# EasyEDA Pro project ProPrj_hackpod.epro

# Schematic Schematic1
Board Name: Board1; Create Date: 2025-11-21; Page Name: P1; Project Name: hackpod; Schematic Name: Schematic1; Update Date: 2025-12-06; Company: wenfeng110402; Drawed: 叶文峰; Page Size: A4; Reviewed: 叶文峰; Version: V1.0
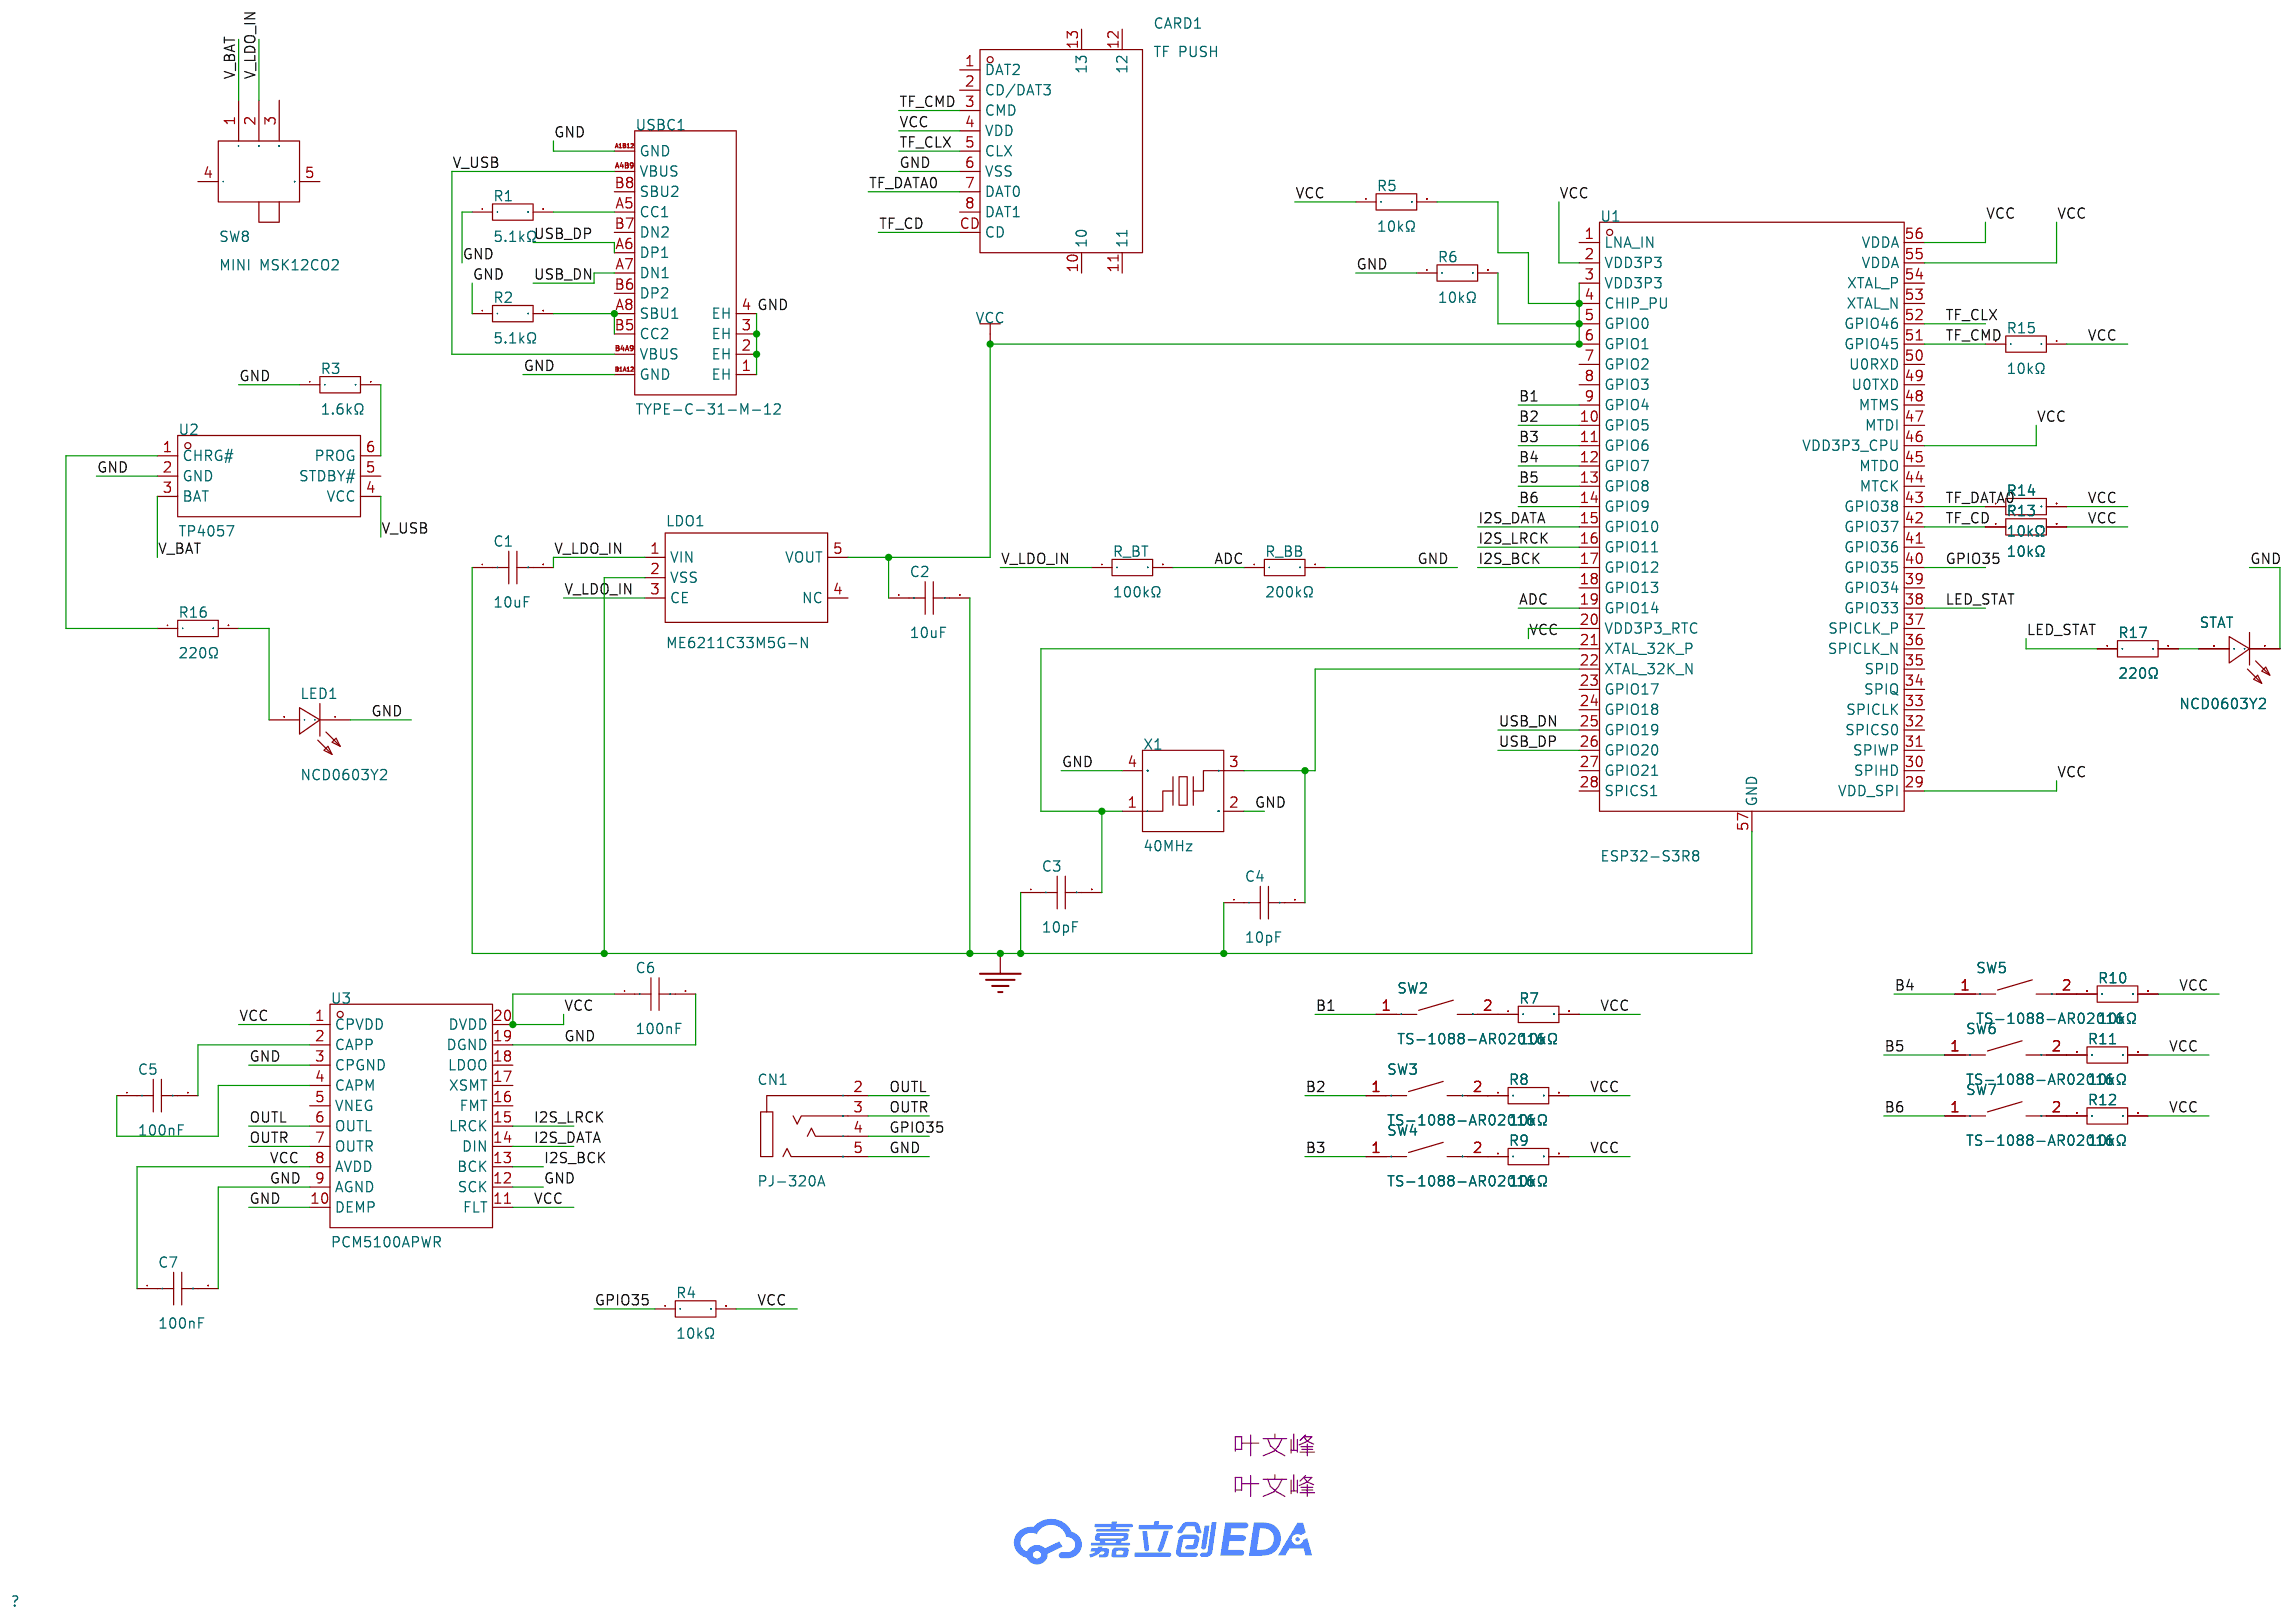
[diagram p0: schematic sheet]

## Parts
C1  10uF  [C0603]
C2  10uF  [C0603]
C3  10pF  [C0603]
C4  10pF  [C0603]
C5  100nF  [C0603]
C6  100nF  [C0603]
C7  100nF  [C0603]
CARD1  TF PUSH  [TF-SMD_TF-PUSH]
CN1  PJ-320A  [AUDIO-TH_PJ-320A_C49284721]
LDO1  ME6211C33M5G-N  [SOT-23-5_L3.0-W1.7-P0.95-LS2.8-BL]
LED1  NCD0603Y2  [LED0603-RD]
R1  5.1kΩ  [R0603]
R2  5.1kΩ  [R0603]
R3  1.6kΩ  [R0603]
R4  10kΩ  [R0603]
R5  10kΩ  [R0603]
R6  10kΩ  [R0603]
R7  10kΩ  [R0603]
R8  10kΩ  [R0603]
R9  10kΩ  [R0603]
R10  10kΩ  [R0603]
R11  10kΩ  [R0603]
R12  10kΩ  [R0603]
R13  10kΩ  [R0603]
R14  10kΩ  [R0603]
R15  10kΩ  [R0603]
R16  220Ω  [R0603]
R17  220Ω  [R0603]
R_BB  200kΩ  [R0603]
R_BT  100kΩ  [R0603]
STAT  NCD0603Y2  [LED0603-RD]
SW2  TS-1088-AR02016  [SW-SMD_L3.9-W3.0-P4.45]
SW3  TS-1088-AR02016  [SW-SMD_L3.9-W3.0-P4.45]
SW4  TS-1088-AR02016  [SW-SMD_L3.9-W3.0-P4.45]
SW5  TS-1088-AR02016  [SW-SMD_L3.9-W3.0-P4.45]
SW6  TS-1088-AR02016  [SW-SMD_L3.9-W3.0-P4.45]
SW7  TS-1088-AR02016  [SW-SMD_L3.9-W3.0-P4.45]
SW8  MINI MSK12CO2  [SW-SMD_MSK12CO2]
U1  ESP32-S3R8  [QFN-56_L7.0-W7.0-P0.40-TL-EP4.0]
U2  TP4057  [SOT-23-6_L2.9-W1.6-P0.95-LS2.8-BR]
U3  PCM5100APWR  [TSSOP-20_L6.5-W4.4-P0.65-LS6.4-BL]
USBC1  TYPE-C-31-M-12  [USB-C_SMD-TYPE-C-31-M-12_1]
X1  40MHz  [CRYSTAL-SMD_4P-L3.2-W2.5-BL]

## Library data of the parts
C1 C2 = CL10A106MA8NRNC: 容值:10uF;精度:±20%;额定电压:25V;温度系数:X5R;; LCSC Part Name: 10uF ±20% 25V; Supplier Part: C96446; Manufacturer: SAMSUNG(三星); Supplier Footprint: 0603; JLCPCB Part Class: Basic Part; Datasheet: https://item.szlcsc.com/datasheet/CL10A106MA8NRNC/97651.html; Supplier: LCSC; Tolerance: ±20%; Voltage Rating: 25V; Temperature Coefficient: X5R
C3 C4 = CL10C100JB8NNNC: 容值:10pF;精度:±5%;额定电压:50V;温度系数:C0G;; LCSC Part Name: 10pF ±5% 50V; Supplier Part: C1634; Manufacturer: SAMSUNG(三星); Supplier Footprint: 0603; JLCPCB Part Class: Basic Part; Datasheet: https://item.szlcsc.com/datasheet/CL10C100JB8NNNC/1986.html; Supplier: LCSC; Tolerance: ±5%; Voltage Rating: 50V; Temperature Coefficient: C0G
C5-C7 = CL10B104KB8NNNC: 容值:100nF;精度:±10%;额定电压:50V;温度系数:X7R;; LCSC Part Name: 100nF ±10% 50V; Supplier Part: C1591; Manufacturer: SAMSUNG(三星); Supplier Footprint: 0603; JLCPCB Part Class: Extended Part; Datasheet: https://item.szlcsc.com/datasheet/CL10B104KB8NNNC/1943.html; Supplier: LCSC; Tolerance: ±10%; Voltage Rating: 50V; Temperature Coefficient: X7R
CARD1 = TF PUSH: 卡连接方式:自弹式;卡类型:MicroSD卡(TF卡);连接器类型:卡座;本体最大高度:2mm;工作温度:-25℃~+90℃;; LCSC Part Name: 自弹式 MicroSD卡(TF卡) 卡座; Supplier Part: C393941; Manufacturer: SHOU HAN(首韩); Supplier Footprint: SMD; JLCPCB Part Class: 扩展库; Datasheet: https://item.szlcsc.com/datasheet/TF%2520PUSH/372553.html; Supplier: LCSC; Card Connection Mode: 自弹式; Card Type: MicroSD卡(TF卡); Connector Type: 卡座; Additional Card Detection Pins: 无; Height Above Board: 2mm; Operating Temperature: -25℃~+90℃
CN1 = PJ-320A_C49284721: 连接器类型:3.5mm耳机座;额定电流:500mA;额定电压:30V;触头材质:铜;触头镀层:金;工作温度:-25℃~+85℃;; LCSC Part Name: 3.5mm耳机座; Supplier Part: C49284721; Manufacturer: XUNPU(讯普); Supplier Footprint: SMD; JLCPCB Part Class: 扩展库; Datasheet: https://item.szlcsc.com/datasheet/PJ-320A/51736270.html; Supplier: LCSC; Connector Type: 3.5mm耳机座; Current Rating: 500mA; Voltage Rating (Max): 30V; Contact Material: 铜; Contact Plating: 金; Operating Temperature: -25℃~+85℃
LDO1 = ME6211C33M5G-N: 输出类型:固定;工作电压:6V;输出电压:3.3V;输出电流:500mA;电源纹波抑制比(PSRR):70dB@(1kHz);输出极性:正极;; LCSC Part Name: 输入6V 输出3.3V 500mA; Supplier Part: C82942; Manufacturer: MICRONE(南京微盟); Supplier Footprint: SOT-23-5; JLCPCB Part Class: 扩展库; Datasheet: https://item.szlcsc.com/datasheet/ME6211C33M5G-N/84106.html; Supplier: LCSC; Output Type: 固定; Voltage - Supply: 6V; Output Voltage: 3.3V; Output Current: 500mA; Power Supply Rejection Ratio (PSRR): 70dB@(1kHz); Voltage Dropout: 120mV@(100mA); standby current: 60uA; Noise: 50uVrms; Features: 过流保护；带使能；短路保护; Operating Temperature: -40℃~+150℃; Output Configuration: 正极; Number of Outputs: 1
LED1 STAT = NCD0603Y2: 发光颜色:黄色;正向电压(VF):1.6V~2.6V;功率:65mW;正向电流:20mA;主波长:586nm~595nm;透镜颜色:无色透明透镜;发光强度:100mcd~220mcd;发光角度:130°;工作温度:-30℃~+85℃;; Supplier Part: C89811; Manufacturer: 国星光电; Supplier Footprint: 0603; JLCPCB Part Class: 扩展库; Datasheet: https://atta.szlcsc.com/upload/public/pdf/source/20200820/C89811_7FE84B429B6BCA3E113B125EE1452576.pdf; Supplier: LCSC; Emitted Color: 黄色; Forward Voltage (VF): 1.6V~2.6V; Power Dissipation: 65mW; Forward Current: 20mA; Dominant Wavelength: 586nm~595nm; Lens Color: 无色透明透镜; Luminous Intensity: 100mcd~220mcd; Viewing Angle: 130°; Operating Temperature: -30℃~+85℃
R1 R2 = 0603WAF5101T5E: 电阻类型:厚膜电阻;阻值:5.1kΩ;精度:±1%;功率:100mW;工作电压:75V;温度系数:±100ppm/℃;; LCSC Part Name: 5.1kΩ ±1% 100mW 厚膜电阻; Supplier Part: C23186; Manufacturer: UNI-ROYAL(厚声); Supplier Footprint: 0603; JLCPCB Part Class: Basic Part; Datasheet: https://item.szlcsc.com/datasheet/0603WAF5101T5E/23913.html; Supplier: LCSC; Type: 厚膜电阻; Tolerance: ±1%; Power(Watts): 100mW; Voltage-Supply(Max): 75V; Temperature Coefficient: ±100ppm/℃; Operating Temperature: -55℃~+155℃
R3 = ERA3AEB162V: 电阻类型:薄膜电阻;阻值:1.6kΩ;精度:±0.1%;功率:100mW;最大工作电压:75V;温度系数:±25ppm/℃;; LCSC Part Name: 1.6kΩ ±0.1% 100mW 薄膜电阻; Supplier Part: C473232; Manufacturer: PANASONIC(松下); Supplier Footprint: 0603; JLCPCB Part Class: Extended Part; Datasheet: https://atta.szlcsc.com/upload/public/pdf/source/20200407/C473232_8F961CC49DDE14D5C98156D145671F58.pdf; Supplier: LCSC; Type: 薄膜电阻; Tolerance: ±0.1%; Power(Watts): 100mW; Overload Voltage (Max): 75V; Temperature Coefficient: ±25ppm/℃; Operating Temperature Range: -55℃~+155℃
R4-R15 = 0603WAF1002T5E: 电阻类型:厚膜电阻;阻值:10kΩ;精度:±1%;功率:100mW;工作电压:75V;温度系数:±100ppm/℃;; LCSC Part Name: 厚膜电阻 10kΩ ±1% 100mW; Supplier Part: C25804; Manufacturer: UNI-ROYAL(厚声); Supplier Footprint: 0603; JLCPCB Part Class: Basic Part; Datasheet: https://item.szlcsc.com/datasheet/0603WAF1002T5E/26547.html; Supplier: LCSC; Type: 厚膜电阻; Tolerance: ±1%; Power(Watts): 100mW; Voltage-Supply(Max): 75V; Temperature Coefficient: ±100ppm/℃; Operating Temperature: -55℃~+155℃
R16 R17 = FRC0603J221 TS: 电阻类型:厚膜电阻;阻值:220Ω;精度:±5%;功率:100mW;工作电压:75V;温度系数:±100ppm/℃;; LCSC Part Name: 220Ω ±5% 100mW 厚膜电阻; Supplier Part: C2907127; Manufacturer: FOJAN(富捷); Supplier Footprint: 0603; JLCPCB Part Class: Extended Part; Supplier: LCSC; Type: 厚膜电阻; Tolerance: ±5%; Power(Watts): 100mW; Voltage-Supply(Max): 75V; Temperature Coefficient: ±100ppm/℃; Operating Temperature: -55℃~+155℃
R_BB = ERA3AEB204V: 电阻类型:薄膜电阻;阻值:200kΩ;精度:±0.1%;功率:100mW;最大工作电压:75V;温度系数:±25ppm/℃;; LCSC Part Name: 200kΩ ±0.1% 100mW 薄膜电阻; Supplier Part: C473261; Manufacturer: PANASONIC(松下); Supplier Footprint: 0603; JLCPCB Part Class: Extended Part; Datasheet: https://atta.szlcsc.com/upload/public/pdf/source/20200515/C543414_D3FB4A44C151AC19BA141503575FC797.pdf; Supplier: LCSC; Type: 薄膜电阻; Tolerance: ±0.1%; Power(Watts): 100mW; Overload Voltage (Max): 75V; Temperature Coefficient: ±25ppm/℃; Operating Temperature Range: -55℃~+155℃
R_BT = ERJ3EKF1003V: 电阻类型:厚膜电阻;阻值:100kΩ;精度:±1%;功率:100mW;工作电压:-;温度系数:±100ppm/℃;; LCSC Part Name: 100kΩ ±1% 100mW 厚膜电阻; Supplier Part: C189597; Manufacturer: PANASONIC(松下); Supplier Footprint: 0603; JLCPCB Part Class: Extended Part; Datasheet: https://item.szlcsc.com/datasheet/ERJ3EKF1003V/201577.html; Supplier: LCSC; Type: 厚膜电阻; Tolerance: ±1%; Power(Watts): 100mW; Temperature Coefficient: ±100ppm/℃; Operating Temperature: -55℃~+155℃
SW2-SW7 = TS-1088-AR02016: 电路结构:单刀单掷;按钮形状:圆形按钮;作用力:1.6N;安装方式:立贴;开关长度:4mm;开关宽度:3mm;开关高度:2mm;带支架:不带支架;触点电流:50mA;额定电压:12V;工作寿命:10万次;; LCSC Part Name: 4*3*2mm 立贴 轻触开关; Supplier Part: C720477; Manufacturer: XUNPU(讯普); Supplier Footprint: SMD,4x3mm; JLCPCB Part Class: 基础库; Datasheet: https://item.szlcsc.com/datasheet/TS-1088-AR02016/763484.html; Supplier: LCSC; Circuit: 单刀单掷; Actuator Style: 圆形按钮; Operating Force: 1.6N; Mounting Type: 立贴; Length: 4mm; Width: 3mm; Switch Height: 2mm; with Bracket: 不带支架; Contact Current: 50mA; Voltage Rating: 12V; Actuator/Cap Color: 黑色; Termination Style: SMD接片; Life: 10万次; Operating Temperature: -30℃~+80℃
SW8 = MINI MSK12CO2: 电路结构:单刀双掷;安装方式:卧贴;开关颜色:白色;额定电流:50mA;额定电压:12V;工作寿命:1万次;; LCSC Part Name: 迷你七脚两档侧拨拨动 mini七7脚 微型拨动; Supplier Part: C2681570; Manufacturer: SHOU HAN(首韩); Supplier Footprint: SMD,5x2.8mm; JLCPCB Part Class: 扩展库; Datasheet: https://item.szlcsc.com/datasheet/MINI%2520MSK12CO2/2774913.html; Supplier: LCSC; Circuit: 单刀双掷; Actuator Style: 矩形柱状; Termination Style: SMD接片; Length: 5mm; Width: 2.75mm; Switch Height: 1.4mm; Mounting Type: 卧贴; Actuator Color: 白色; Current Rating: 50mA; Voltage Rating: 12V; Life: 1万次; Operating Temperature: -25℃~+70℃
U1 = ESP32-S3R8: 频率范围:2.412GHz~2.484GHz;接口类型:I2C；I2S；UART；USB；SPI;应用领域:蓝牙；IoT；WiFi;数据速率:150Mbps;灵敏度:-74.2dBm;典型应用频率:2.4GHz;; LCSC Part Name: 2.4GHz Wi-Fi + 低功耗蓝牙系统级芯片（SoC）; Supplier Part: C2913194; Manufacturer: ESPRESSIF(乐鑫); Supplier Footprint: QFN-56(7x7); JLCPCB Part Class: 扩展库; Datasheet: https://item.szlcsc.com/datasheet/ESP32-S3R8/3198292.html; Supplier: LCSC; Frequency Range: 2.412GHz~2.484GHz; Interface: I2C；I2S；UART；USB；SPI; Voltage - Supply: 3V~3.6V; Applications: 蓝牙；IoT；WiFi; Output Power: 18.5dBm; Data Rate: 150Mbps; Current Of Transmitting: 283mA; Sensitivity: -74.2dBm; Receive Current: 88mA; Typical Application Frequency: 2.4GHz; Operating Temperature: -40℃~+65℃; Type: 收发器
U2 = TP4057: 工作电压:4V~6.5V;最大充电电流:500mA;电池类型:锂离子;电池节数:1;; Supplier Part: C725791; Manufacturer: UMW(友台半导体); Supplier Footprint: SOT-23-6; JLCPCB Part Class: 扩展库; Datasheet: https://item.szlcsc.com/datasheet/TP4057/772194.html; Supplier: LCSC; The Chip Type: 充电芯片; Voltage - Supply: 4V~6.5V; Charge Current - Max: 500mA; Charging Saturation Voltage: 4.24V; Type of Battery: 锂离子; Number of Cells: 1; Operating Temperature: -40℃~+85℃; Battery Temperature Detection: 支持; Supply Current (Iq): 25uA
U3 = PCM5100APWR: 工作电压:1.8V~3.3V;接口类型:I2S;; LCSC Part Name: 具有PLL和32位、384kHz PCM接口的音频立体声DAC; Supplier Part: C131154; Manufacturer: TI(德州仪器); Supplier Footprint: TSSOP-20; JLCPCB Part Class: 扩展库; Datasheet: https://www.ti.com/cn/lit/gpn/pcm5102a; Supplier: LCSC; Voltage - Supply: 1.8V~3.3V; Interface Type: I2S
USBC1 = TYPE-C-31-M-12: 连接器类型:Type-C;协议标准:-;公母:母;安装方式:-;触点数量:16P;端口数量:1;额定电流 - 电源:5A;工作温度:-;; LCSC Part Name: Type-C 母; Supplier Part: C165948; Manufacturer: 韩国韩荣; Supplier Footprint: SMD; JLCPCB Part Class: 扩展库; Datasheet: https://item.szlcsc.com/datasheet/TYPE-C-31-M-12/177331.html; Supplier: LCSC; Connector Type: Type-C; Gender: 母; Number of Contacts: 16P; Number of Ports: 1; Current Rating-Power: 5A
X1 = XL2EL89CPI-111YLC-40M: 晶振类型:贴片晶振;频率:40MHz;常温频差:±10ppm;负载电容:15pF;频率稳定度:±20ppm;; LCSC Part Name: YSX321SL 40MHZ 4P 3225 15PF ±10PPM -40~85℃ (±20PPM); Supplier Part: C5444549; Manufacturer: YXC(扬兴晶振); Supplier Footprint: SMD3225-4P; JLCPCB Part Class: 扩展库; Datasheet: https://item.szlcsc.com/datasheet/XL2EL89CPI-111YLC-40M/6336545.html; Supplier: LCSC; Type: 贴片晶振; Normal temperature Frequency Tolerance: ±10ppm; Load Capacitance: 15pF; Frequency Stability: ±20ppm; Operating Temperature: -40℃~+85℃

## Nets
GND: C1.1 C2.2 C3.1 C4.1 C6.2 C7.2 CARD1.6(VSS) CN1.5 LDO1.2(VSS) LED1.1(K) R1.1 R2.1 R3.1 R6.1 R_BB.2 STAT.1(K) U1.57(GND) U2.2(GND) U3.3(CPGND) U3.9(AGND) U3.10(DEMP) U3.12(SCK) U3.19(DGND) USBC1.1(EH) USBC1.2(EH) USBC1.3(EH) USBC1.4(EH) USBC1.A1B12(GND) USBC1.B1A12(GND) X1.2(GND) X1.4(GND)
VCC: C2.1 C6.1 C7.1 CARD1.4(VDD) LDO1.5(VOUT) R4.2 R5.1 R5.2 R6.2 R7.2 R8.2 R9.2 R10.2 R11.2 R12.2 R13.2 R14.2 R15.2 U1.2(VDD3P3) U1.3(VDD3P3) U1.4(CHIP_PU) U1.5(GPIO0) U1.6(GPIO1) U1.20(VDD3P3_RTC) U1.29(VDD_SPI) U1.46(VDD3P3_CPU) U1.55(VDDA) U1.56(VDDA) U3.1(CPVDD) U3.8(AVDD) U3.11(FLT) U3.20(DVDD)
ADC: R_BB.1 R_BT.2 U1.19(GPIO14)
B1: SW2.1 U1.9(GPIO4)
B2: SW3.1 U1.10(GPIO5)
B3: SW4.1 U1.11(GPIO6)
B4: SW5.1 U1.12(GPIO7)
B5: SW6.1 U1.13(GPIO8)
B6: SW7.1 U1.14(GPIO9)
GPIO35: CN1.4 R4.1 U1.40(GPIO35)
I2S_BCK: U1.17(GPIO12) U3.13(BCK)
I2S_DATA: U1.15(GPIO10) U3.14(DIN)
I2S_LRCK: U1.16(GPIO11) U3.15(LRCK)
LED_STAT: R17.1 U1.38(GPIO33)
OUTL: CN1.2 U3.6(OUTL)
OUTR: CN1.3 U3.7(OUTR)
TF_CD: CARD1.CD R13.1 U1.42(GPIO37)
TF_CLX: CARD1.5(CLX) U1.52(GPIO46)
TF_CMD: CARD1.3(CMD) R15.1 U1.51(GPIO45)
TF_DATA0: CARD1.7(DAT0) R14.1 U1.43(GPIO38)
USB_DN: U1.25(GPIO19) USBC1.A7(DN1)
USB_DP: U1.26(GPIO20) USBC1.A6(DP1)
V_BAT: SW8.1 U2.3(BAT)
V_LDO_IN: C1.2 LDO1.1(VIN) LDO1.3(CE) R_BT.1 SW8.2
V_USB: U2.4(VCC) USBC1.A4B9(VBUS) USBC1.B4A9(VBUS)
$1N1223: C3.2 U1.21(XTAL_32K_P) X1.1
$1N1229: C4.2 U1.22(XTAL_32K_N) X1.3
$1N2072: R1.2 USBC1.A5(CC1)
$1N2076: R2.2 USBC1.A8(SBU1) USBC1.B5(CC2)
$1N2223: R3.2 U2.6(PROG)
$1N2848: C5.2 U3.2(CAPP)
$1N2853: C5.1 U3.4(CAPM)
$1N3768: R7.1 SW2.2
$1N3800: R8.1 SW3.2
$1N3832: R9.1 SW4.2
$1N3864: R10.1 SW5.2
$1N3896: R11.1 SW6.2
$1N3928: R12.1 SW7.2
$1N4567: R16.1 U2.1(CHRG#)
$1N4573: LED1.2(A) R16.2
$1N5751: R17.2 STAT.2(A)

Not connected (* = marked no-connect by the designer): CARD1 1(DAT2) 2(CD/DAT3) 8(DAT1) 10 11 12 13; LDO1 4(NC); SW8 3 4 5; U1 1(LNA_IN) 7(GPIO2) 8(GPIO3) 18(GPIO13) 23(GPIO17) 24(GPIO18) 27(GPIO21) 28(SPICS1) 30(SPIHD) 31(SPIWP) 32(SPICS0) 33(SPICLK) 34(SPIQ) 35(SPID) 36(SPICLK_N) 37(SPICLK_P) 39(GPIO34) 41(GPIO36) 44(MTCK) 45(MTDO) 47(MTDI) 48(MTMS) 49(U0TXD) 50(U0RXD) 53(XTAL_N) 54(XTAL_P); U2 5(STDBY#); U3 5(VNEG) 16(FMT) 17(XSMT) 18(LDOO); USBC1 B6(DP2) B7(DN2) B8(SBU2)

# Board PCB1
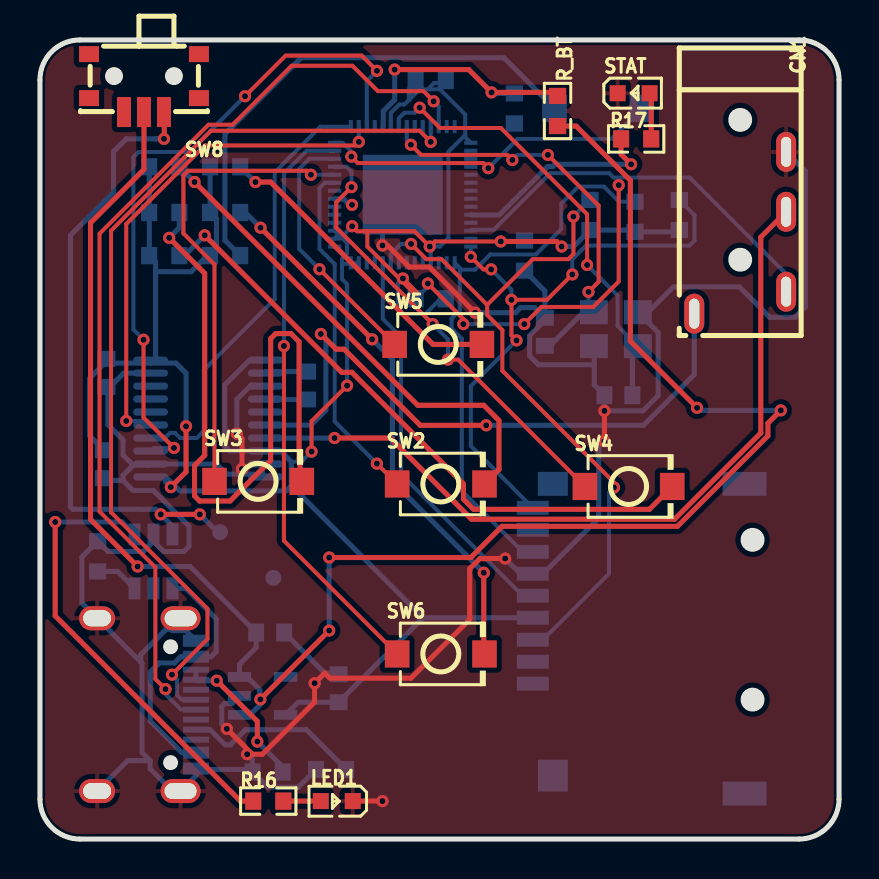
[diagram p1: board, top side]
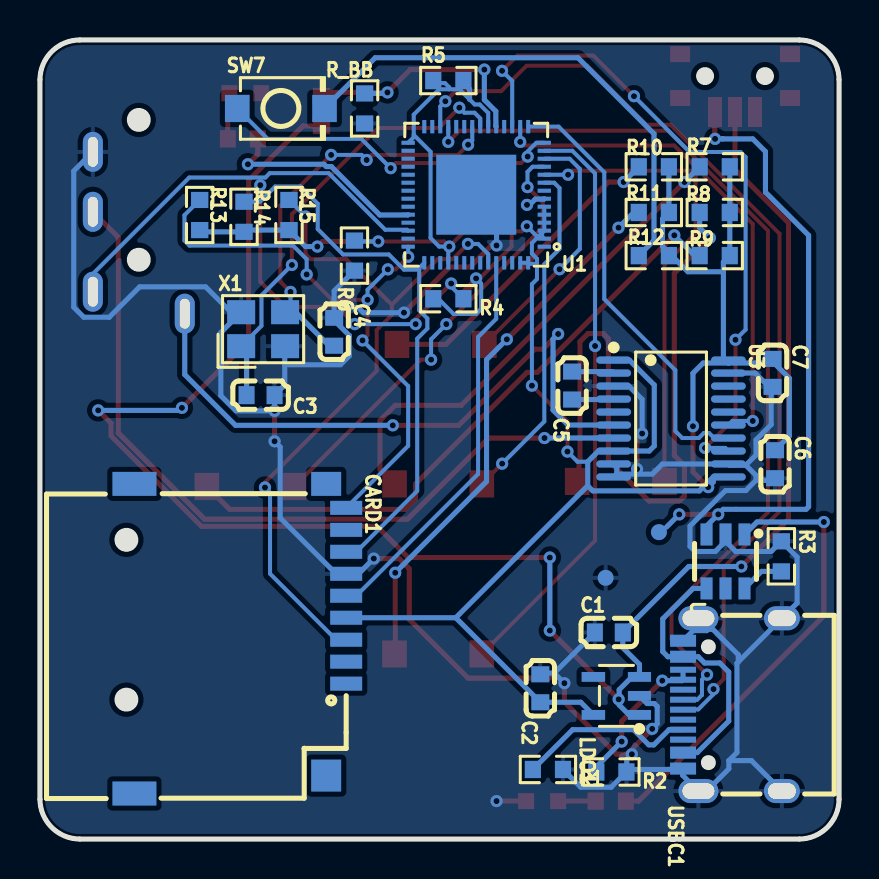
[diagram p2: board, bottom side, seen from below]

Outline 40 x 40 mm; copper layers: Top Layer, Bottom Layer. Coordinates in mm from the lower left corner of the outline.
Outline path: 0,38 0,2 arc(0.59,0.59) 2,0 38,0 arc(39.41,0.59) 40,2 40,38 arc(39.41,39.41) 38,40 2,40 arc(0.59,39.41) 0,38
Stack: Top Layer 0.035mm / Dielectric1 1.51mm FR4 er 4.5 / Bottom Layer 0.035mm

## Design rules (mm)
template: JLCPCB Capability(Two Layers Board)
spacing copperThickness1oz (default): track to track 0.102, other pairs 0.152 to 0.3
spacing copperThickness2oz: track to track 0.203, other pairs 0.152 to 0.3
track width copperThickness1oz (default): min 0.127, default 0.254, max 2.54
track width copperThickness2oz: min 0.203, default 0.254, max 2.54
differential pair differentialPair (default): width min 0.127, default 0.254, max 2.54; gap min 0.152, default 0.152
via viaSize (default): diameter min 0.5, default 0.61, max 10; hole min 0.3, default 0.305, max 6.3

## Placement (name value [footprint] x y rotation side)
C1  10uF  [C0603]  11.52 10.34 180 bottom
C2  10uF  [C0603]  14.95 7.55 90 bottom
C3  10pF  [C0603]  28.96 22.22 0 bottom
C4  10pF  [C0603]  25.27 25.39 270 bottom
C5  100nF  [C0603]  13.36 22.7 90 bottom
C6  100nF  [C0603]  3.2 18.76 270 bottom
C7  100nF  [C0603]  3.33 23.33 270 bottom
CARD1  TF PUSH  [TF-SMD_TF-PUSH]  29.97 10.03 270 bottom
CN1  PJ-320A  [AUDIO-TH_PJ-320A_C49284721]  35.05 30.35 270 top
LDO1  ME6211C33M5G-N  [SOT-23-5_L3.0-W1.7-P0.95-LS2.8-BL]  11.14 7.17 90 bottom
LED1  NCD0603Y2  [LED0603-RD]  14.86 1.9 180 top
NOREF  -  [Pad_e67966]  11.68 13.08 0 top
NOREF#2  -  [Pad_e67964]  9.02 15.36 0 top
R1  5.1kΩ  [R0603]  14.57 3.48 0 bottom
R2  5.1kΩ  [R0603]  11.4 3.36 0 bottom
R3  1.6kΩ  [R0603]  2.89 14.15 270 bottom
R4  10kΩ  [R0603]  19.56 27.05 0 bottom
R5  10kΩ  [R0603]  19.56 37.97 180 bottom
R6  10kΩ  [R0603]  24.26 29.2 90 bottom
R7  10kΩ  [R0603]  6.22 33.65 180 bottom
R8  10kΩ  [R0603]  6.22 31.36 180 bottom
R9  10kΩ  [R0603]  6.22 29.2 180 bottom
R10  10kΩ  [R0603]  9.27 33.65 180 bottom
R11  10kΩ  [R0603]  9.27 31.36 180 bottom
R12  10kΩ  [R0603]  9.27 29.2 180 bottom
R13  10kΩ  [R0603]  32 31.24 270 bottom
R14  10kΩ  [R0603]  29.79 31.15 270 bottom
R15  10kΩ  [R0603]  27.53 31.24 270 bottom
R16  220Ω  [R0603]  11.43 1.9 0 top
R17  220Ω  [R0603]  29.84 35.05 0 top
R_BB  200kΩ  [R0603]  23.75 36.57 270 bottom
R_BT  100kΩ  [R0603]  25.91 36.44 90 top
STAT  NCD0603Y2  [LED0603-RD]  29.72 37.33 0 top
SW2  TS-1088-AR02016  [SW-SMD_L3.9-W3.0-P4.45]  20.07 17.77 0 top
SW3  TS-1088-AR02016  [SW-SMD_L3.9-W3.0-P4.45]  10.92 17.9 0 top
SW4  TS-1088-AR02016  [SW-SMD_L3.9-W3.0-P4.45]  29.46 17.65 0 top
SW5  TS-1088-AR02016  [SW-SMD_L3.9-W3.0-P4.45]  19.94 24.76 0 top
SW6  TS-1088-AR02016  [SW-SMD_L3.9-W3.0-P4.45]  20.07 9.27 0 top
SW7  TS-1088-AR02016  [SW-SMD_L3.9-W3.0-P4.45]  27.94 36.57 180 bottom
SW8  MINI MSK12CO2  [SW-SMD_MSK12CO2]  5.21 37.84 180 top
U1  ESP32-S3R8  [QFN-56_L7.0-W7.0-P0.40-TL-EP4.0]  18.16 32.25 0 bottom
U2  TP4057  [SOT-23-6_L2.9-W1.6-P0.95-LS2.8-BR]  5.68 13.9 90 bottom
U3  PCM5100APWR  [TSSOP-20_L6.5-W4.4-P0.65-LS6.4-BL]  8.41 21.05 270 bottom
USBC1  TYPE-C-31-M-12  [USB-C_SMD-TYPE-C-31-M-12_1]  5.33 6.73 90 bottom
X1  40MHz  [CRYSTAL-SMD_4P-L3.2-W2.5-BL]  28.83 25.52 180 bottom

## Footprints (pads in the part's own frame, mm; a bottom-side part is the same pattern mirrored in y, then rotated)
AUDIO-TH_PJ-320A_C49284721
  oval 2x1 hole 1.5x0.5: 2(4.05,-2.3) 3(-1.05,2.3) 4(2.95,2.3) 5(-4.05,2.3)
C0603
  rect 0.8x0.9 smd: 1(-0.7,0) 2(0.7,0)
CRYSTAL-SMD_4P-L3.2-W2.5-BL
  rect 1.4x1.2 smd: 1(-1.1,-0.85) 2(1.1,-0.85) 3(1.1,0.85) 4(-1.1,0.85)
LED0603-RD
  rect 0.8x0.8 smd: 1(-0.799,0) 2(0.799,0)
Pad_e67964
  round 0.8 smd far side: 1(0,0)
Pad_e67966
  round 0.8 smd far side: 1(0,0)
QFN-56_L7.0-W7.0-P0.40-TL-EP4.0
  rect 0.665x0.2 smd: 1(-3.408,2.6) 2(-3.408,2.2) 3(-3.408,1.8) 4(-3.408,1.4) 5(-3.408,1) 6(-3.408,0.6) 7(-3.408,0.2) 8(-3.408,-0.2) 9(-3.408,-0.6) 10(-3.408,-1) 11(-3.408,-1.4) 12(-3.408,-1.8) 13(-3.408,-2.2) 14(-3.408,-2.6) 29(3.408,-2.6) 30(3.408,-2.2) 31(3.408,-1.8) 32(3.408,-1.4) 33(3.408,-1) 34(3.408,-0.6) 35(3.408,-0.2) 36(3.408,0.2) 37(3.408,0.6) 38(3.408,1) 39(3.408,1.4) 40(3.408,1.8) 41(3.408,2.2) 42(3.408,2.6)
  rect 0.2x0.665 smd: 15(-2.6,-3.408) 16(-2.2,-3.408) 17(-1.8,-3.408) 18(-1.4,-3.408) 19(-1,-3.408) 20(-0.6,-3.408) 21(-0.2,-3.408) 22(0.2,-3.408) 23(0.6,-3.408) 24(1,-3.408) 25(1.4,-3.408) 26(1.8,-3.408) 27(2.2,-3.408) 28(2.6,-3.408) 43(2.6,3.408) 44(2.2,3.408) 45(1.8,3.408) 46(1.4,3.408) 47(1,3.408) 48(0.6,3.408) 49(0.2,3.408) 50(-0.2,3.408) 51(-0.6,3.408) 52(-1,3.408) 53(-1.4,3.408) 54(-1.8,3.408) 55(-2.2,3.408) 56(-2.6,3.408)
  rect 4x4 smd: 57(0,0)
R0603
  rect 0.806x0.864 smd: 1(-0.753,0) 2(0.753,0)
SOT-23-5_L3.0-W1.7-P0.95-LS2.8-BL
  rect 0.49x1.157 smd: 1(-0.95,-1.153) 2(0,-1.153) 3(0.95,-1.153)
  rect 0.49x1.175 smd: 4(0.95,1.153) 5(-0.95,1.153)
SOT-23-6_L2.9-W1.6-P0.95-LS2.8-BR
  rect 1.1x0.6 smd: 1(1.35,-0.95) 2(1.35,0) 3(1.35,0.95) 4(-1.35,0.95) 5(-1.35,0) 6(-1.35,-0.95)
SW-SMD_L3.9-W3.0-P4.45
  rect 1.23x1.36 smd: 1(-2.185,0) 2(2.185,0)
SW-SMD_MSK12CO2
  rect 0.7x1.5 smd: 1(-1,1.45) 2(0,1.45) 3(1,1.45)
  rect 1x0.8 smd: 4(-2.75,0.75) 4(-2.75,-1.45) 5(2.75,0.75) 5(2.75,-1.45)
TF-SMD_TF-PUSH
  rect 0.7x1.6 smd: 1(2.25,5.3) 2(1.15,5.3) 3(0.05,5.3) 4(-1.05,5.3) 5(-2.15,5.3) 6(-3.25,5.3) 7(-4.35,5.3) 8(-5.45,5.3) CD(-6.55,5.3)
  rect 1.2x1.5 smd: 10(-7.75,4.3)
  rect 1.2x2.2 smd: 11(-7.75,-5.3) 12(7.75,-5.3)
  rect 1.6x1.5 smd: 13(6.85,4.3)
TSSOP-20_L6.5-W4.4-P0.65-LS6.4-BL
  oval 0.364x1.742 smd: 1(-2.925,-2.871) 2(-2.275,-2.871) 3(-1.625,-2.871) 4(-0.975,-2.871) 5(-0.325,-2.871) 6(0.325,-2.871) 7(0.975,-2.871) 8(1.625,-2.871) 9(2.275,-2.871) 10(2.925,-2.871) 11(2.925,2.871) 12(2.275,2.871) 13(1.625,2.871) 14(0.975,2.871) 15(0.325,2.871) 16(-0.325,2.871) 17(-0.975,2.871) 18(-1.625,2.871) 19(-2.275,2.871) 20(-2.925,2.871)
USB-C_SMD-TYPE-C-31-M-12_1
  oval 1.2x2 hole 0.8x1.6: 1(4.325,1.706) 4(-4.325,1.706)
  oval 1.2x1.8 hole 0.8x1.4: 2(4.325,-2.474) 3(-4.325,-2.474)
  custom 0.6x1.3 smd: A1B12(-3.2,2.474) A4B9(-2.4,2.474) B1A12(3.2,2.474) B4A9(2.401,2.474)
  rect 0.3x1.3 smd: A5(-1.25,2.474) A6(-0.25,2.474) A7(0.25,2.474) A8(1.25,2.474) B5(1.75,2.474) B6(0.75,2.474) B7(-0.75,2.474) B8(-1.75,2.474)

## Nets
As in the schematic, except:
GND: C1.1 C2.2 C3.1 C4.1 C6.2 C7.2 CARD1.6 CN1.5 LDO1.2 LED1.1 NOREF.1 R1.1 R2.1 R3.1 R6.1 R_BB.2 STAT.1 U1.57 U2.2 U3.3 U3.9 U3.10 U3.12 U3.19 USBC1.1 USBC1.2 USBC1.3 USBC1.4 USBC1.A1B12 USBC1.B1A12 X1.2 X1.4
V_BAT: NOREF#2.1 SW8.1 U2.3

Pads without a net: CARD1 1 2 8 10 11 12 13; LDO1 4; SW8 3 4 5; U1 1 7 8 18 23 24 27 28 30 31 32 33 34 35 36 37 39 41 44 45 47 48 49 50 53 54; U2 5; U3 5 16 17 18; USBC1 B6 B7 B8

## Via types
v1: diameter 0.61, hole 0.305, Top Layer to Bottom Layer, 83 vias

## Routing (per net, layer and track width the routed paths; a pad name or vN(x,y) marks a point on that pad's centre or on a via; arc(x,y) is an arc through that point)
GND: length 155.9
  Top Layer w0.254: LED1.1 v1(17.14,1.9) ; v1(10.11,18.52) 10.11,20.04 v1(9.86,20.3) ; v1(23.29,14.04) 22.02,14.04 21.51,13.53 21.51,10.99 18.57,8.05 14.51,8.05 14.26,8.31 v1(13.75,7.8) 13.75,6.86 11.13,4.24 10.62,4.24 ; v1(21.78,26.35) 19.49,28.63 18.48,28.63 17.4,29.71 v1(17.14,29.71) ; 10.62,4.24 v1(9.36,5.51) ; 10.62,4.24 v1(10.37,4.24) ; v1(28.26,19.91) v1(28.26,21.43)
  Bottom Layer w0.254: 27.75,23.74 27.75,22.73 C3.1 v1(28.26,21.43) 30.18,21.43 30.95,22.2 30.95,25.36 30.18,26.12 ; 27.75,23.74 27.75,24.65 X1.2 ; 27.75,23.74 24.95,23.74 24.51,24.19 24.51,25.2 25.27,25.96 25.27,26.09 ; 14.95,8.25 14.89,8.31 14.26,8.31 ; 11.13,18.27 11.13,18.62 U3.9 ; 11.13,18.27 10.11,18.27 ; 11.13,18.27 U3.10 ; 30.18,26.12 X1.4 ; 30.18,26.12 31.71,27.64 35.01,27.64 36.53,26.12 37.8,26.12 38.31,26.63 38.31,33.44 CN1.5 ; 10.11,18.27 9.35,18.27 8.84,18.77 5.54,18.77 5.48,18.71 4.67,18.71 ; 10.11,18.27 v1(10.11,18.52) ; 5.52,3.92 5.11,4.33 5.11,8.8 5.04,8.87 ; 5.52,3.92 4.38,3.92 2.86,2.4 ; 5.52,3.92 5.52,3.51 6.63,2.4 7.04,2.4 7.83,3.19 7.83,3.48 ; 7.83,3.48 USBC1.A1B12 ; 7.83,3.48 10.62,3.48 ; 5.04,8.87 USBC1.2 2.1,11.81 2.1,14.11 R3.1 3.4,14.4 5.17,14.4 5.68,14.9 ; 5.04,8.87 5.04,9.23 6.31,10.5 6.57,10.5 6.63,10.43 ; v1(9.36,5.51) 9.1,5.77 9.1,6.64 9.25,6.78 9.61,6.78 LDO1.2 ; 6.63,10.43 7.3,10.43 USBC1.B1A12 ; 6.63,10.43 6.63,10.64 USBC1.1 ; 25.27,26.09 25.27,27.44 R6.1 ; 25.27,26.09 24.77,26.6 24.06,26.6 23.81,26.35 v1(21.78,26.35) ; v1(17.14,29.71) 17.14,31.24 U1.57 ; R1.1 12.93,2.59 11.41,2.59 R2.1 10.62,3.38 10.62,3.48 ; 4.16,17.95 3.31,17.95 C6.2 ; 4.16,17.95 4.16,18.21 4.67,18.71 ; 4.16,17.95 4.67,17.44 5.68,17.44 7.46,15.67 7.46,14.65 7.21,14.4 6.19,14.4 5.68,14.9 ; 4.67,18.71 4.16,19.22 4.16,19.98 3.4,20.75 3.4,22.52 ; 14.26,8.31 v1(13.75,7.8) ; 14.26,8.31 C1.1 ; 5.54,23.32 4.2,23.32 3.4,22.52 ; 5.68,14.9 U2.2 ; 3.4,22.52 C7.2 ; U3.3 10.52,22.67 9.86,22.01 v1(9.86,20.3) ; v1(10.37,4.24) 10.62,3.99 10.62,3.48 ; v1(28.26,19.91) 27.97,19.63 27.97,16.07 25.18,13.28 CARD1.6 24.05,13.28 v1(23.29,14.04)
VCC: length 137.6
  Top Layer w0.2: v1(13.6,19.39) 13.6,20.92 v1(15.37,22.7) ; v1(23.07,29.91) 19.76,29.91 v1(19.51,29.66) 18.75,30.42 16.39,30.42 ; v1(15.63,30.67) 15.88,30.42 16.39,30.42 ; 16.39,30.42 16.39,29.66 18.75,27.3 18.84,27.3 18.84,27.39 v1(18.17,28.06)
  Top Layer w0.254: v1(6.55,17.62) 7.31,18.38 v1(7.31,20.66) ; v1(26.11,29.66) 25.86,29.91 v1(23.07,29.91)
  Bottom Layer w0.2: v1(15.63,30.67) 15.12,30.17 15.04,30.17 ; 14.87,30.34 14.87,30.17 ; 14.87,30.34 U1.3 U1.5 U1.6 ; 14.87,30.34 15.04,30.17 ; 14.87,30.17 15.04,30.17 ; 14.87,30.17 14.75,30.05 ; U1.55 U1.56 15.51,28.79 15.12,28.79 ; 15.12,28.79 15.12,28.03 15.37,27.78 v1(15.37,22.7) ; 15.12,28.79 15.12,29.05 15.37,29.3 15.37,29.83 15.04,30.17 ; v1(13.6,19.39) 13.09,18.89 12.58,18.89 ; 21.57,34.85 21.29,35.13 21.29,35.25 ; 21.29,35.25 20.45,34.4 20.45,30.09 20.02,29.66 v1(19.51,29.66) 19.56,29.61 U1.46 ; 21.29,35.25 21.29,36.26 20.02,37.53 19.51,37.53 ; 19.51,37.53 19.51,37.63 19.73,37.84 20.32,37.84 ; 19.51,37.53 19,37.53 18.24,36.77 17.99,36.77 17.56,36.34 U1.20 ; v1(23.07,29.91) 24.21,29.91 R6.2 ; R4.2 20.06,27.05 19.3,26.28 18.17,26.28 17.91,26.54 17.91,27.81 v1(18.17,28.06)
  Bottom Layer w0.254: R10.2 R11.2 8.84,31.04 8.84,29.67 8.33,29.16 ; C6.1 2.49,20.18 2.49,23.06 3.25,23.83 3.54,23.83 ; R7.2 R8.2 R9.2 5.79,28.89 5.79,28.4 ; 6.3,18.12 6.3,17.87 v1(6.55,17.62) ; 6.3,18.12 6.99,17.43 12.33,17.43 12.58,17.68 ; 6.3,18.12 5.54,18.12 ; 18.49,37.02 18.49,37.54 18.92,37.97 ; 5.53,23.83 5.79,24.08 5.79,28.4 ; 5.53,23.83 6.8,23.83 7.31,23.32 v1(7.31,20.66) ; 5.53,23.83 5.54,23.97 ; 5.53,23.83 3.54,23.83 ; 8.33,29.16 8.47,29.16 R12.2 ; 8.33,29.16 7.57,28.4 5.79,28.4 ; 19.18,11.08 C2.1 12.93,6.85 LDO1.5 ; 19.18,11.08 12.58,17.68 ; 19.18,11.08 CARD1.4 ; 12.58,17.68 12.58,18.89 12.04,19.42 U3.8 9.5,19.42 9.25,19.68 9.25,22.73 10.5,23.97 U3.1 ; 3.54,23.83 C7.1 ; v1(26.11,29.66) 26.71,29.66 R15.2 29.7,30.48 R14.2 31.91,30.39 R13.2
(no net): length 1
  Bottom Layer w0.254: 14.75,32.05 14.77,32.03 15.2,32.03 15.49,31.74 v1(15.62,31.74)
ADC: length 13
  Top Layer w0.254: v1(17.76,38.52) 21.46,38.52 v1(22.61,37.37) 25.73,37.37 R_BT.2
  Bottom Layer w0.254: U1.19 17.18,35.68 17.18,36.43 17.76,37 v1(17.76,38.52) ; v1(22.61,37.37) 22.66,37.32 R_BB.1
B1: length 17.3
  Top Layer w0.2: SW2.1 v1(16.86,18.79)
  Bottom Layer w0.2: 14.75,32.85 14.26,32.85 13.99,32.59 13.99,29.54 14.75,28.78 14.75,20.9 v1(16.86,18.79)
B2: length 23.7
  Top Layer w0.2: v1(13.56,33.25) 13.36,33.45 7.41,33.45 7.18,33.22 7.18,30.32 8.74,28.76 8.74,17.9
  Bottom Layer w0.2: v1(13.56,33.25) U1.10
B3: length 22.5
  Top Layer w0.2: v1(20.42,24) 20.93,24 SW4.1 ; v1(19.66,25.78) 14.83,30.6 14.83,31.87 v1(15.59,32.63)
  Bottom Layer w0.2: v1(20.42,24) 20.42,25.01 v1(19.66,25.78) ; v1(15.59,32.63) 15.59,33.4 15.34,33.65 U1.11
B4: length 12.8
  Top Layer w0.2: SW5.1 v1(13.99,28.52)
  Bottom Layer w0.2: v1(13.99,28.52) 12.98,29.54 12.98,33.54 13.48,34.05 14.75,34.05
B5: length 29.4
  Top Layer w0.2: SW6.1 12.21,14.93 v1(12.21,24.68)
  Bottom Layer w0.2: U1.13 13.35,34.45 12.21,33.32 v1(12.21,24.68)
B6: length 17.3
  Top Layer w0.2: v1(15.59,34.16) 15.91,33.84 22.19,33.84 v1(22.45,33.58)
  Bottom Layer w0.2: 14.75,34.85 15.15,34.85 15.59,34.42 v1(15.59,34.16) ; SW7.1 28.6,35.05 23.91,35.05 v1(22.45,33.58)
GPIO35: length 37.2
  Top Layer w0.2: v1(19.42,27.81) 21.19,26.03 v1(21.19,25.78) ; v1(24.24,25.78) 25.1,26.64 27.7,26.64 28.97,27.91 v1(28.97,32.73)
  Bottom Layer w0.2: v1(24.24,25.78) v1(21.19,25.78) ; CN1.4 37.35,28.29 32.53,33.11 28.72,33.11 28.5,33.33 25.55,33.33 22.72,30.5 21.63,30.5 21.58,30.45 ; v1(19.42,27.81) 19.42,27.66 R4.1
I2S_BCK: length 34.3
  Top Layer w0.2: v1(6.71,19.58) 5.18,21.1 v1(5.18,24.99) ; v1(10.27,37.18) 12.3,39.22 16.11,39.22 v1(16.87,38.45)
  Bottom Layer w0.2: v1(16.87,38.45) 16.36,37.95 16.36,35.66 ; v1(10.27,37.18) 7.47,34.39 4.93,34.39 4.68,34.14 4.68,25.5 v1(5.18,24.99) ; 5.54,19.42 5.69,19.58 v1(6.71,19.58)
I2S_DATA: length 22.2
  Bottom Layer w0.2: 5.54,20.07 6.26,20.07 6.51,20.33 6.76,20.33 7.02,20.07 7.85,20.07 8.2,20.42 8.2,23.47 11.75,27.02 11.75,33.37 14.04,35.66 U1.15
I2S_LRCK: length 25.3
  Top Layer w0.2: v1(4.32,20.93) 4.32,30.79 8.25,34.72 15.78,34.72 v1(15.96,34.9)
  Bottom Layer w0.2: 5.54,20.72 5.33,20.93 v1(4.32,20.93) ; U1.16 v1(15.96,34.9)
LED_STAT: length 10.6
  Top Layer w0.254: v1(29.59,33.78) 29.09,34.28 R17.1
  Bottom Layer w0.254: U1.38 21.58,31.24 22.99,31.24 25.41,33.66 25.67,33.66 25.78,33.78 v1(29.59,33.78)
OUTL: length 31.9
  Top Layer w0.254: v1(22.34,20.71) 19.04,20.71 15.23,24.52 14.82,24.52 v1(14.06,25.28)
  Bottom Layer w0.254: v1(22.34,20.71) 30.21,20.71 32.75,23.25 CN1.2 ; U3.6 13.57,20.72 14.32,21.47 14.32,25.03 v1(14.06,25.28)
OUTR: length 39.9
  Top Layer w0.254: CN1.3 36.08,30.13 36.08,20.33 31.76,16.01 21.6,16.01 17.54,20.07 v1(14.75,20.07)
  Bottom Layer w0.254: v1(14.75,20.07) U3.7
TF_CD: length 29.7
  Top Layer w0.2: v1(23.85,24.96) 23.6,25.21 v1(23.6,26.99) 25.38,26.99 v1(26.65,28.26) ; v1(21.57,29.14) 22.2,28.52 v1(22.58,28.52)
  Bottom Layer w0.2: v1(23.6,26.99) 23.6,27.5 v1(22.58,28.52) ; R13.1 32.77,31.23 32.77,29.96 32.51,29.7 27.33,29.7 26.65,29.02 v1(26.65,28.26) ; v1(23.85,24.96) 21.57,22.67 21.57,19.68 CARD1.CD ; v1(21.57,29.14) U1.42
TF_CLX: length 20.1
  Bottom Layer w0.2: CARD1.5 24.16,12.18 18.07,18.27 18.07,25.13 17.16,26.04 U1.52
TF_CMD: length 36.5
  Top Layer w0.2: 22.39,26.74 24.67,29.03 26.45,29.03 26.7,29.28 v1(26.7,31.16) ; 22.39,26.74 20.1,29.03 19.34,29.03 v1(18.58,29.79) ; 22.39,26.74 22.39,26.23 23.15,25.47 23.15,23.44 28.74,17.85 v1(28.74,17.6)
  Bottom Layer w0.2: U1.51 17.56,29.28 18.07,29.79 v1(18.58,29.79) ; CARD1.3 25.18,9.98 28.48,13.28 28.48,17.34 v1(28.74,17.6) ; v1(26.7,31.16) R15.1
TF_DATA0: length 28.3
  Bottom Layer w0.2: 21.02,28.5 21.02,28.59 20.76,28.85 ; 21.02,28.5 21.02,26.47 20.61,26.06 20.61,25.55 21.12,25.05 21.12,17.43 24.16,14.38 CARD1.7 ; 21.02,28.5 21.78,28.5 22.54,29.26 24.83,29.26 26.09,30.53 26.09,31.8 26.95,32.66 28.23,32.66 28.99,31.9 R14.1
USB_DN: length 46.2
  Top Layer w0.2: v1(19.56,34.9) 19,35.46 8.56,35.46 3.56,30.45 3.56,16.36 8.39,11.53 8.39,10.01 v1(6.61,8.23)
  Bottom Layer w0.2: U1.25 v1(19.56,34.9) ; USBC1.A7 7.1,6.98 6.86,7.21 6.86,7.97 v1(6.61,8.23)
USB_DP: length 48.6
  Top Layer w0.2: v1(19.71,36.93) 19.2,37.44 16.91,37.44 15.64,38.71 12.59,38.71 9.64,35.76 8.44,35.76 2.98,30.3 2.98,16.4 5.78,13.6 5.78,8.01 v1(6.28,7.51)
  Bottom Layer w0.2: v1(19.71,36.93) 19.96,36.68 U1.26 ; USBC1.A6 7.79,6.49 7.05,6.49 6.28,7.25 v1(6.28,7.51)
V_BAT: length 31.3
  Top Layer w0.254: 6.22,35.05 6.22,36.45 ; v1(6.05,16.25) 8,16.25 v1(8,16.25)
  Bottom Layer w0.254: 5.83,35.05 5.83,35.06 5.84,35.05 4.32,35.05 3.68,34.41 3.68,32.38 1.52,30.22 1.52,16.63 1.65,16.51 5.8,16.51 v1(6.05,16.25) 6.63,15.67 U2.3 ; v1(8,16.25) 8.64,15.62
  vias: v1(6.21,35.05)
V_LDO_IN: length 94.4
  Top Layer w0.254: v1(4.89,13.64) 2.53,16 2.53,30.85 5.21,33.52 5.21,36.45 ; R_BT.1 26.84,35.69 29.55,32.97 29.55,24.92 v1(32.89,21.58) ; v1(37.08,21.46) 36.44,20.81 36.44,20.18 31.91,15.65 23.13,15.65 21.57,14.09 v1(14.48,14.09) ; v1(11.03,6.99) v1(14.48,10.44)
  Bottom Layer w0.254: 9.99,8.24 9.99,8.74 10.82,9.58 C1.2 7.52,13.64 v1(4.89,13.64) ; 9.99,8.24 LDO1.3 ; 9.99,8.24 10.24,8.24 11.01,7.47 11.01,6.71 10.51,6.22 LDO1.1 ; v1(37.08,21.46) 33.02,21.46 v1(32.89,21.58) ; v1(14.48,10.44) v1(14.48,14.09)
V_USB: length 13.6
  Bottom Layer w0.254: U2.4 7.3,12.55 8.82,11.02 8.82,9.38 8.57,9.13 USBC1.B4A9 7.05,9.13 6.73,8.81 5.97,8.81 5.52,8.36 5.52,5.9 7.1,4.33 USBC1.A4B9
$1N1223: length 22.5
  Top Layer w0.2: v1(19.01,36.61) 20.02,35.59 23.07,35.59 27.39,31.28 v1(27.39,28.74)
  Bottom Layer w0.2: v1(27.39,28.74) 28.91,27.21 28.91,25.69 X1.1 ; v1(19.01,36.61) 18.75,36.36 18.24,36.36 17.96,36.07 U1.21
  Bottom Layer w0.254: C3.2 29.66,24.4 X1.1
$1N1229: length 20.6
  Top Layer w0.2: v1(25.43,34.25) 27.97,31.71 27.97,27.9 v1(27.46,27.39) ; v1(23.65,33.99) 23.39,34.25 19.08,34.25 v1(18.57,34.75)
  Bottom Layer w0.2: v1(23.65,33.99) 23.9,34.25 v1(25.43,34.25) ; 18.36,35.66 18.36,34.96 v1(18.57,34.75) ; 27.46,26.37 v1(27.46,27.39)
  Bottom Layer w0.254: C4.2 25.53,24.69 27.2,26.37 X1.3
$1N2072: length 9
  Bottom Layer w0.254: USBC1.A5 8.51,5.48 9.27,4.71 9.52,4.71 10.28,5.48 13.33,5.48 R1.2
$1N2076: length 7.5
  Top Layer w0.254: v1(10.88,4.88) 10.88,5.9 v1(8.85,7.93)
  Bottom Layer w0.254: R2.2 12.15,3.61 v1(10.88,4.88) ; v1(8.85,7.93) 7.86,7.93 USBC1.A8 USBC1.B5
$1N2223: length 2.2
  Bottom Layer w0.254: R3.2 3.88,13.4 U2.6
$1N2848: length 2.1
  Bottom Layer w0.254: U3.2 11.36,23.4 C5.2
$1N2853: length 2.1
  Bottom Layer w0.254: U3.4 11.31,22 C5.1
$1N3768: length 24.7
  Top Layer w0.254: v1(7.74,32.89) 18.91,21.71 22.22,21.71 22.98,20.95 22.98,18.5 SW2.2
  Bottom Layer w0.254: R7.1 v1(7.74,32.89)
$1N3800: length 34.9
  Top Layer w0.254: v1(6.47,30.09) 8.25,28.32 8.25,19.21 7.74,18.7 7.74,17.17 7.99,16.92 9.52,16.92 11.55,18.95 11.55,25.05 11.8,25.3 12.56,25.3 12.97,24.9 12.97,19.05 SW3.2
  Bottom Layer w0.254: v1(6.47,30.09) 6.98,30.6 R8.1
$1N3832: length 31.7
  Top Layer w0.254: v1(8.25,30.22) 15.1,23.36 15.61,23.36 21.2,17.77 21.2,17.01 21.71,16.5 30.51,16.5 SW4.2
  Bottom Layer w0.254: R9.1 7.23,29.2 v1(8.25,30.22)
$1N3864: length 15.8
  Top Layer w0.254: v1(10.79,32.89) 11.55,32.89 19.68,24.76 SW5.2
  Bottom Layer w0.254: R10.1 v1(10.79,32.89)
$1N3896: length 27.3
  Top Layer w0.254: SW6.2 22.22,9.3 v1(22.22,13.33) ; v1(11.04,30.6) v1(16.63,25.01)
  Bottom Layer w0.254: v1(11.04,30.6) 10.28,31.36 R11.1 ; v1(22.22,13.33) 17.64,17.9 17.64,24 v1(16.63,25.01)
$1N3928: length 25.5
  Bottom Layer w0.254: SW7.2 23.21,39.11 13.07,39.11 9.26,35.3 9.26,29.97 R12.1
$1N4567: length 22.7
  Top Layer w0.254: R16.1 10.03,1.9 0.76,11.17 v1(0.76,15.87)
  Bottom Layer w0.254: U2.1 4.11,15.87 v1(0.76,15.87)
$1N4573: length 1.9
  Top Layer w0.254: R16.2 LED1.2
$1N5751: length 2.3
  Top Layer w0.254: STAT.2 30.6,37.25 R17.2

## Copper pours and planes (outline as drawn; the poured copper is in the pictures)
GND on Top Layer: -3.81,48.13 41.15,48.13 41.15,-3.18 -3.81,-3.18
GND on Bottom Layer: -3.43,46.86 43.31,46.86 43.31,-3.31 -3.43,-3.31
